# EasyEDA Pro project ProProject_阵列式磁场检测仪_2024-06-02.epro, board PCB3
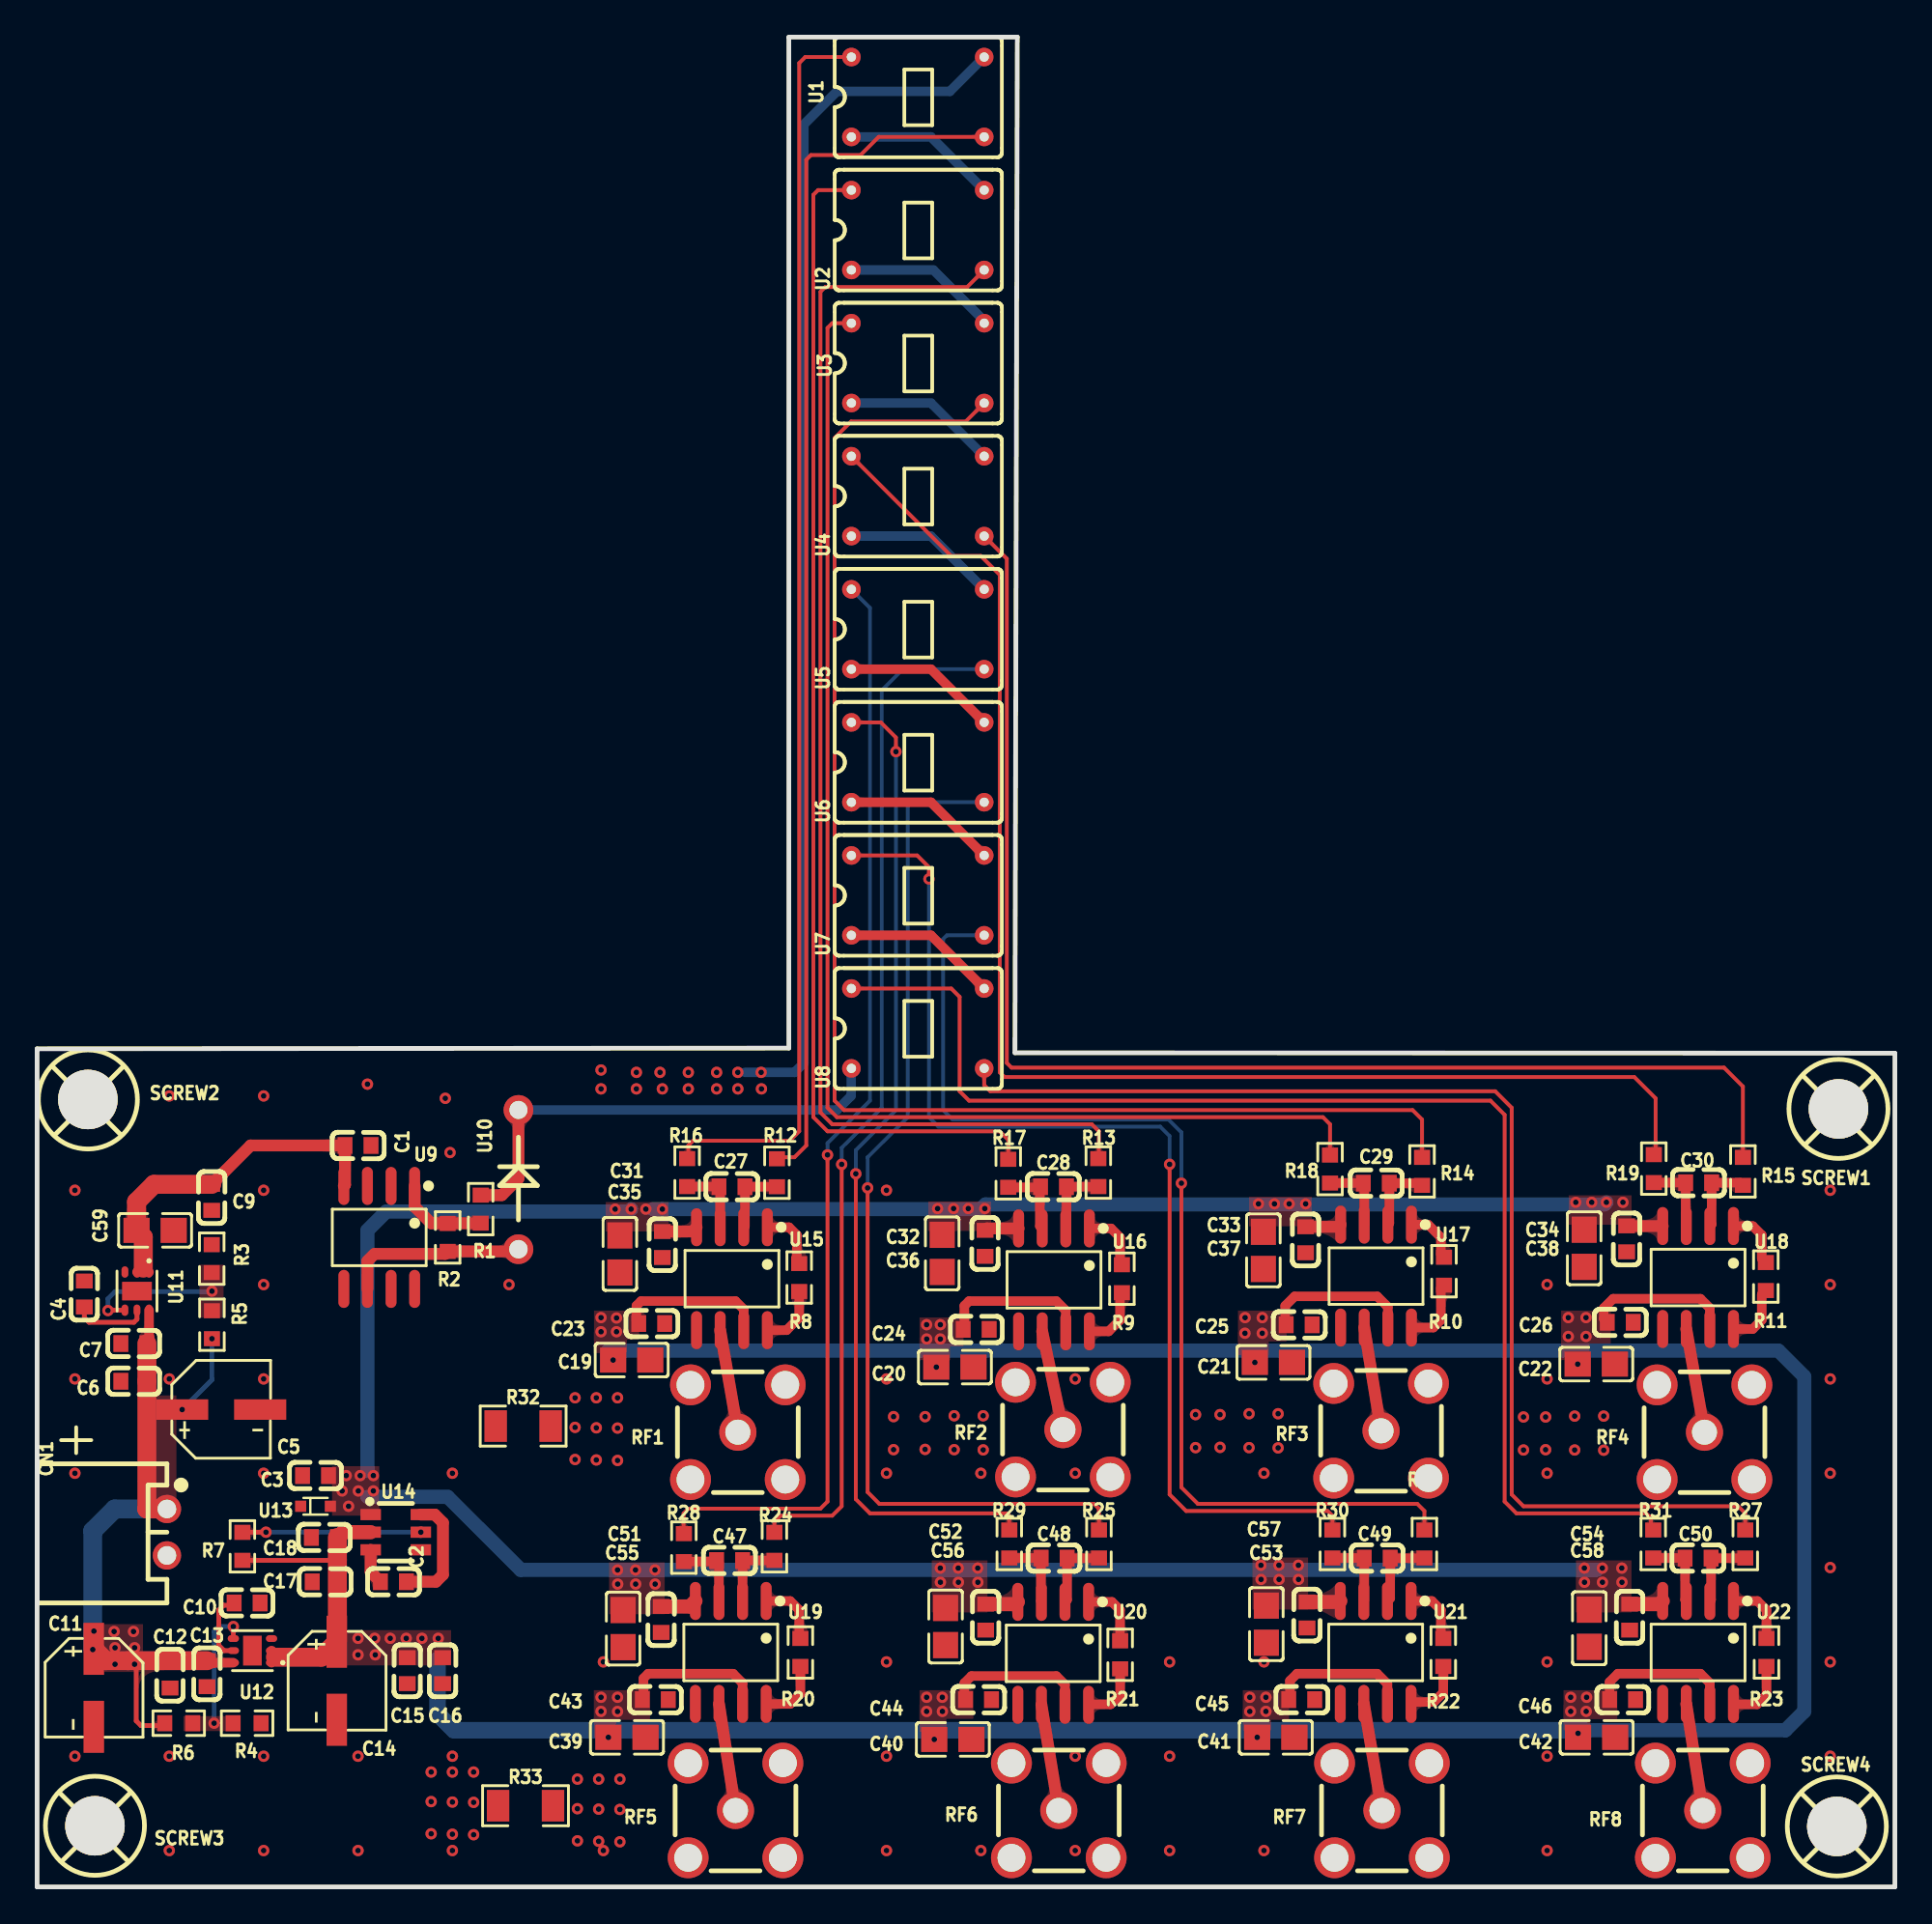
[diagram p8: board, top side]
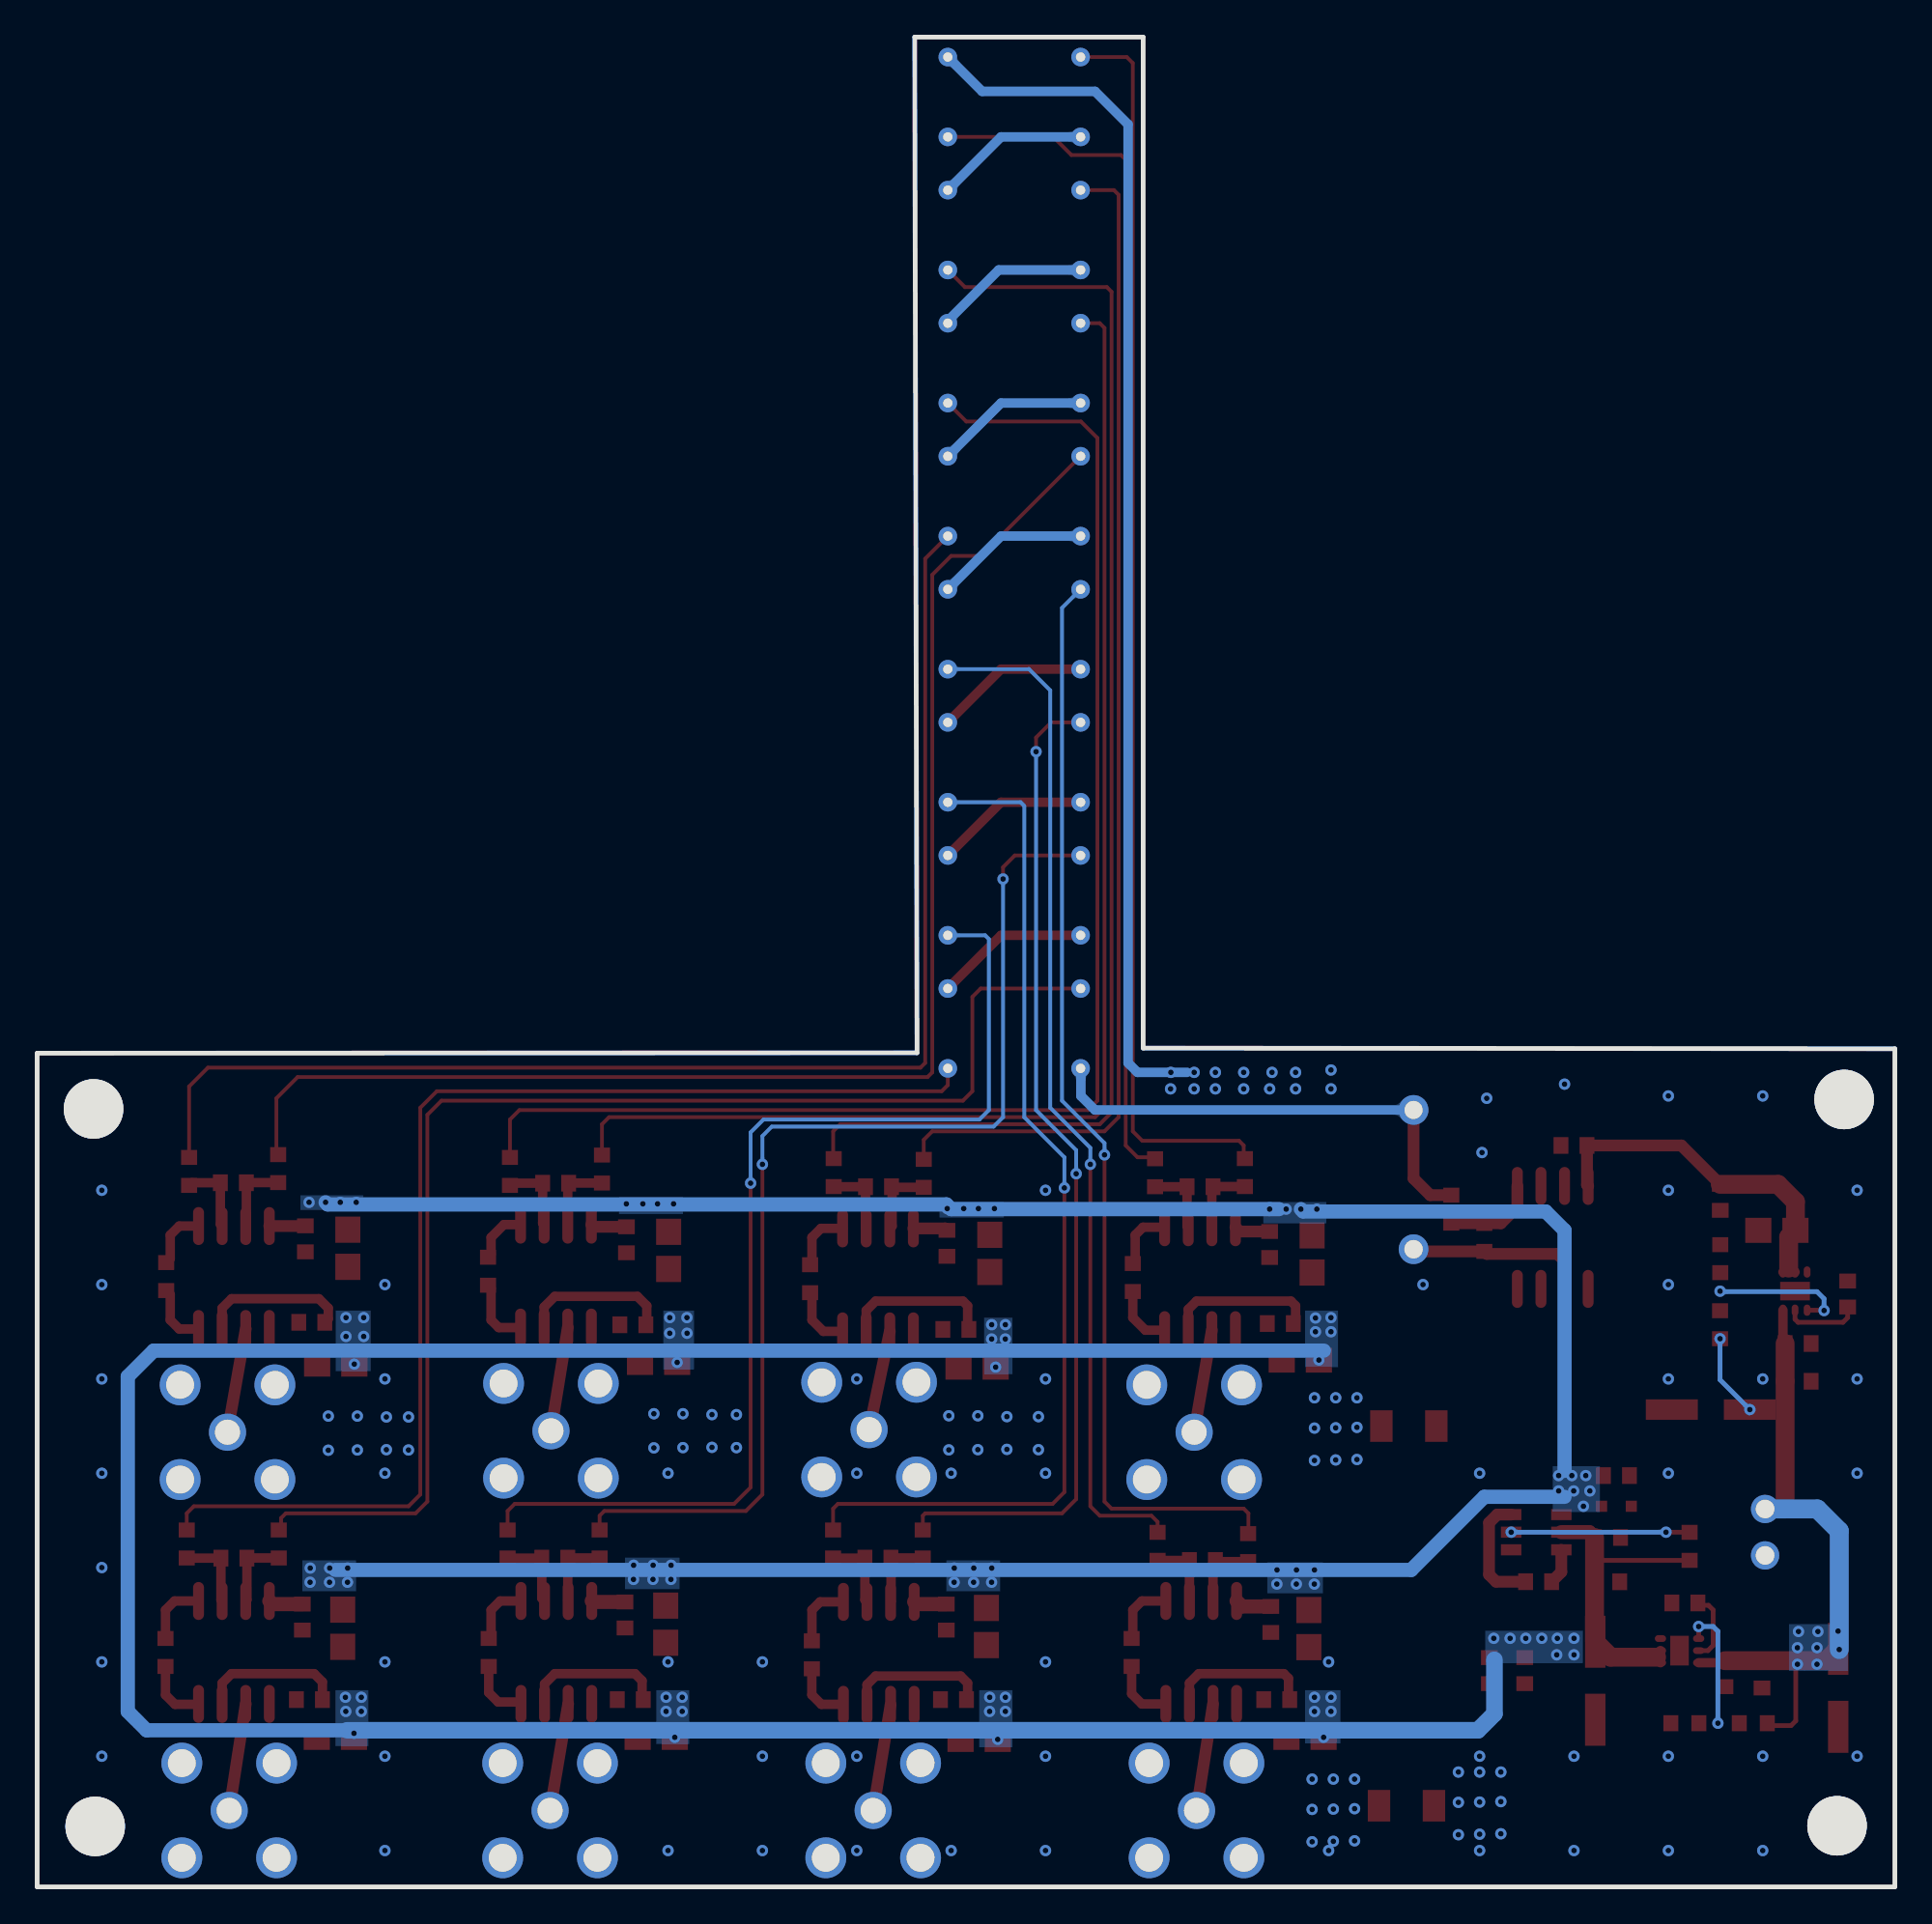
[diagram p9: board, bottom side, seen from below]

Outline 100 x 99.62 mm; copper layers: Top Layer, Bottom Layer. Coordinates in mm from the lower left corner of the outline.
Outline path: 0,45.14 0,0 100,0 100,44.9 52.63,44.92 52.76,99.62 40.46,99.62 40.46,45.17 0,45.14
Stack: Top Layer 0.035mm / Dielectric1 1.51mm FR4 er 4.5 / Bottom Layer 0.035mm

## Design rules (mm)
template: 自定义配置
spacing copperThickness1oz (default): track to track 0.102, other pairs 0.152 to 0.3
spacing copperThickness2oz: track to track 0.203, other pairs 0.152 to 0.3
track width copperThickness1oz (default): min 0.127, default 0.254, max 2.54
track width copperThickness2oz: min 0.203, default 0.254, max 2.54
differential pair differentialPair (default): width min 0.127, default 0.254, max 2.54; gap min 0.152, default 0.152
via viaSize (default): diameter min 0.5, default 0.61, max 10; hole min 0.3, default 0.305, max 6.3

## Placement (name value [footprint] x y rotation side)
C1  100nF  [C0603]  17.27 39.93 180 top
C2  3.3uF  [C0603]  19.18 16.43 180 top
C3  3.3uF  [C0603]  14.99 22.15 0 top
C4  1nF  [C0603]  2.54 31.93 90 top
C5  10uF  [CAP-SMD_BD5.0-L5.3-W5.3-FD]  9.91 25.7 0 top
C6  2.2uF  [C0603]  5.21 27.23 0 top
C7  100nF  [C0603]  5.21 29.26 0 top
C9  2.2uF  [C0603]  9.4 37.14 90 top
C10  1nF  [C0603]  11.3 15.29 0 top
C11  10uF  [CAP-SMD_BD5.0-L5.3-W5.3-FD]  3.05 10.72 270 top
C12  2.2uF  [C0603]  7.15 11.41 90 top
C13  100nF  [C0603]  9.14 11.48 90 top
C14  10uF  [CAP-SMD_BD5.0-L5.3-W5.3-FD]  16.13 11.1 270 top
C15  2.2uF  [C0603]  19.92 11.65 90 top
C16  100nF  [C0603]  21.83 11.65 90 top
C17  3.3uF  [C0603]  15.51 16.43 0 top
C18  100nF  [C0603]  15.46 18.82 0 top
C19  10uF  [C0805]  32 28.37 180 top
C20  10uF  [C0805]  49.4 27.99 180 top
C21  10uF  [C0805]  66.55 28.25 180 top
C22  10uF  [C0805]  83.93 28.15 180 top
C23  100nF  [C0603]  33.08 30.34 180 top
C24  100nF  [C0603]  50.55 30.02 180 top
C25  100nF  [C0603]  67.93 30.27 180 top
C26  100nF  [C0603]  85.22 30.4 180 top
C27  47nF  [C0603]  37.4 37.71 0 top
C28  47nF  [C0603]  54.71 37.71 0 top
C29  47nF  [C0603]  72.09 37.9 0 top
C30  47nF  [C0603]  89.44 37.92 0 top
C31  10uF  [C0805]  31.37 34.09 90 top
C32  10uF  [C0805]  48.72 34.12 90 top
C33  10uF  [C0805]  66.01 34.28 90 top
C34  10uF  [C0805]  83.28 34.39 90 top
C35  100nF  [C0603]  33.65 34.59 90 top
C36  100nF  [C0603]  51.03 34.66 90 top
C37  100nF  [C0603]  68.28 34.85 90 top
C38  100nF  [C0603]  85.56 34.9 90 top
C39  10uF  [C0805]  31.75 8.05 180 top
C40  10uF  [C0805]  49.29 7.94 180 top
C41  10uF  [C0805]  66.67 8.05 180 top
C42  10uF  [C0805]  83.95 8.05 180 top
C43  100nF  [C0603]  33.27 10.08 180 top
C44  100nF  [C0603]  50.67 10.08 180 top
C45  100nF  [C0603]  68.07 10.08 180 top
C46  100nF  [C0603]  85.34 10.08 180 top
C47  47nF  [C0603]  37.27 17.58 0 top
C48  47nF  [C0603]  54.74 17.7 0 top
C49  47nF  [C0603]  72.14 17.7 0 top
C50  47nF  [C0603]  89.41 17.7 0 top
C51  10uF  [C0805]  31.54 13.91 90 top
C52  10uF  [C0805]  48.9 14.02 90 top
C53  10uF  [C0805]  66.17 14.15 90 top
C54  10uF  [C0805]  83.55 13.93 90 top
C55  100nF  [C0603]  33.59 14.4 90 top
C56  100nF  [C0603]  51.06 14.53 90 top
C57  100nF  [C0603]  68.36 14.64 90 top
C58  100nF  [C0603]  85.73 14.53 90 top
C59  10uF  [C0805]  6.35 35.36 0 top
CN1  XH2.54-2P_H弯针插座  [CONN-TH_2P-P2.5_XH2.54-2P_H]  6.98 19.1 270 top
R1  13kΩ  [R0603]  23.88 36.5 90 top
R2  1.3kΩ  [R0603]  22.1 34.98 270 top
R3  24kΩ  [R0603]  9.4 33.83 90 top
R4  24kΩ  [R0603]  11.3 8.81 0 top
R5  150kΩ  [R0603]  9.41 30.28 90 top
R6  150kΩ  [R0603]  7.62 8.81 0 top
R7  10K  [R0603]  11.05 18.34 270 top
R8  499Ω  [R0603]  41.02 32.82 90 top
R9  499Ω  [R0603]  58.39 32.75 90 top
R10  499Ω  [R0603]  75.73 33.16 90 top
R11  499Ω  [R0603]  93.06 32.87 90 top
R12  1kΩ  [R0603]  39.82 38.46 90 top
R13  1kΩ  [R0603]  57.12 38.47 90 top
R14  1kΩ  [R0603]  74.55 38.53 90 top
R15  1kΩ  [R0603]  91.82 38.53 90 top
R16  1kΩ  [R0603]  34.99 38.47 90 top
R17  1kΩ  [R0603]  52.27 38.43 90 top
R18  1kΩ  [R0603]  69.6 38.66 90 top
R19  1kΩ  [R0603]  87.03 38.68 90 top
R20  499Ω  [R0603]  41.08 12.62 90 top
R21  499Ω  [R0603]  58.3 12.5 90 top
R22  499Ω  [R0603]  75.69 12.62 90 top
R23  499Ω  [R0603]  93.09 12.62 90 top
R24  1kΩ  [R0603]  39.69 18.34 90 top
R25  1kΩ  [R0603]  57.16 18.47 90 top
R26  1kΩ  [R0603]  74.68 18.47 90 top
R27  1kΩ  [R0603]  91.95 18.47 90 top
R28  1kΩ  [R0603]  34.81 18.27 90 top
R29  1kΩ  [R0603]  52.33 18.47 90 top
R30  1kΩ  [R0603]  69.72 18.47 90 top
R31  1kΩ  [R0603]  86.99 18.47 90 top
R32  0Ω  [R1206]  26.16 24.82 0 top
R33  0Ω  [R1206]  26.29 4.37 0 top
RF1  BWSMA-KE-Z001  [SMA-TH_BWSMA-KE-Z001]  37.72 24.49 90 top
RF2  BWSMA-KE-Z001  [SMA-TH_BWSMA-KE-Z001]  55.22 24.63 90 top
RF3  BWSMA-KE-Z001  [SMA-TH_BWSMA-KE-Z001]  72.34 24.56 90 top
RF4  BWSMA-KE-Z001  [SMA-TH_BWSMA-KE-Z001]  89.75 24.49 90 top
RF5  BWSMA-KE-Z001  [SMA-TH_BWSMA-KE-Z001]  37.59 4.12 90 top
RF6  BWSMA-KE-Z001  [SMA-TH_BWSMA-KE-Z001]  55 4.12 90 top
RF7  BWSMA-KE-Z001  [SMA-TH_BWSMA-KE-Z001]  72.39 4.12 90 top
RF8  BWSMA-KE-Z001  [SMA-TH_BWSMA-KE-Z001]  89.66 4.12 90 top
SCREW1  -  [M3螺丝]  97.03 41.83 0 top
SCREW2  -  [M3螺丝]  2.79 42.34 0 top
SCREW3  -  [M3螺丝]  3.17 3.23 0 top
SCREW4  -  [M3螺丝]  96.94 3.19 0 top
U1  -  [HALL]  42.93 93.14 90 top
U2  -  [HALL]  42.93 85.98 90 top
U3  -  [HALL]  42.93 78.81 90 top
U4  -  [HALL]  42.93 71.64 90 top
U5  -  [HALL]  42.93 64.48 90 top
U6  -  [HALL]  42.93 57.31 90 top
U7  -  [HALL]  42.93 50.14 90 top
U8  -  [HALL]  42.93 42.98 90 top
U9  LM234DT  [SOIC-8_L4.9-W3.9-P1.27-LS6.0-BL]  18.41 34.98 180 top
U10  -  [IN457]  25.91 34.34 90 top
U11  SGM2211-5.0XTDI6G/TR  [TDFN-6_L2.0-W2.0-P0.65-BL-EP]  5.37 32.09 180 top
U12  SGM2211-5.0XTDI6G/TR  [TDFN-6_L2.0-W2.0-P0.65-BL-EP]  11.59 12.72 90 top
U13  IN4148WT  [SOD-523_L1.2-W0.8-LS1.6-FD]  14.99 20.5 180 top
U14  SGM3204YN6G/TR  [SOT-23-6_L2.9-W1.6-P0.95-LS2.8-BR]  19.3 19.1 180 top
U15  INA101ASOIC8  [SOIC-8_L4.9-W3.9-P1.27-LS6.0-BL]  37.4 32.75 180 top
U16  INA101ASOIC8  [SOIC-8_L4.9-W3.9-P1.27-LS6.0-BL]  54.74 32.69 180 top
U17  INA101ASOIC8  [SOIC-8_L4.9-W3.9-P1.27-LS6.0-BL]  72.07 32.89 180 top
U18  INA101ASOIC8  [SOIC-8_L4.9-W3.9-P1.27-LS6.0-BL]  89.41 32.82 180 top
U19  INA101ASOIC8  [SOIC-8_L4.9-W3.9-P1.27-LS6.0-BL]  37.34 12.62 180 top
U20  INA101ASOIC8  [SOIC-8_L4.9-W3.9-P1.27-LS6.0-BL]  54.69 12.58 180 top
U21  INA101ASOIC8  [SOIC-8_L4.9-W3.9-P1.27-LS6.0-BL]  72.05 12.62 180 top
U22  INA101ASOIC8  [SOIC-8_L4.9-W3.9-P1.27-LS6.0-BL]  89.41 12.62 180 top

## Footprints (pads in the part's own frame, mm; a bottom-side part is the same pattern mirrored in y, then rotated)
C0603
  rect 0.8x0.9 smd: 1(-0.7,0) 2(0.7,0)
C0805
  rect 1.41x1.35 smd: 1(-1,0) 2(1,0)
CAP-SMD_BD5.0-L5.3-W5.3-FD
  rect 2.8x1.1 smd: 1(-2.1,0) 2(2.1,0)
CONN-TH_2P-P2.5_XH2.54-2P_H
  round 1.524 hole 1: 1(-1.25,0) 2(1.25,0)
HALL
  round 1 hole 0.5: 1(1.104,-0.904) 2(1.104,-8.053) 3(5.404,-8.053) 4(5.404,-0.904)
IN457
  round 1.6 hole 0.99x0.97: 1(0,0)
  round 1.6 hole 0.97: 2(7.5,0)
M3螺丝
  round 3.2 hole 3.2: 1(-0.064,0.064)
R0603
  rect 0.806x0.864 smd: 1(-0.753,0) 2(0.753,0)
R1206
  rect 1.208x1.701 smd: 1(-1.479,0) 2(1.479,0)
SMA-TH_BWSMA-KE-Z001
  round 2.2 hole 1.5: 1(-2.55,-2.55) 2(-2.55,2.55) 3(2.55,2.55) 4(2.55,-2.55)
  round 2 hole 1.35: 5(0,0)
SOD-523_L1.2-W0.8-LS1.6-FD
  rect 0.6x0.6 smd: 1(-0.8,0) 2(0.8,0)
SOIC-8_L4.9-W3.9-P1.27-LS6.0-BL
  oval 0.588x2.045 smd: 1(-1.905,-2.772) 2(-0.635,-2.772) 3(0.635,-2.772) 4(1.905,-2.772) 5(1.905,2.772) 6(0.635,2.772) 7(-0.635,2.772) 8(-1.905,2.772)
SOT-23-6_L2.9-W1.6-P0.95-LS2.8-BR
  rect 1.1x0.6 smd: 1(1.35,-0.95) 2(1.35,0) 3(1.35,0.95) 4(-1.35,0.95) 5(-1.35,0) 6(-1.35,-0.95)
TDFN-6_L2.0-W2.0-P0.65-BL-EP
  oval 0.364x0.607 smd: 1(-0.65,-1.028) 2(0,-1.028) 3(0.65,-1.028) 4(0.65,1.028) 5(0,1.028) 6(-0.65,1.028)
  rect 1.6x1 smd: 7(0,0)

## Nets
As in the schematic.

Pads without a net: SCREW1 1; SCREW2 1; SCREW3 1; SCREW4 1; U9 2 3 5 7 8

## Via types
v1: diameter 0.61, hole 0.305, Top Layer to Bottom Layer, 241 vias

## Routing (per net, layer and track width the routed paths; a pad name or vN(x,y) marks a point on that pad's centre or on a via; arc(x,y) is an arc through that point)
5V: length 241.2
  Top Layer w0.254: 16.16,17.61 16.14,17.59 R7.2
  Top Layer w0.508: U12.2 U12.1 ; C24.2 49.91,30.09 49.91,31.29 50.17,31.55 54.86,31.55 55.37,31.04 U16.7 ; C23.2 32.26,30.46 32.26,31.29 32.51,31.55 37.59,31.55 38.04,31.1 U15.7 ; C43.2 32.64,10.15 32.64,11.23 32.89,11.48 37.46,11.48 37.97,10.97 U19.7 ; C45.2 67.44,10.15 67.44,11.1 67.82,11.48 72.14,11.48 72.69,10.93 U21.7 ; C26.2 84.33,30.59 84.33,31.17 84.84,31.67 89.53,31.67 90.04,31.17 U18.7 ; C25.2 67.18,30.32 67.18,31.29 67.69,31.8 72.14,31.8 72.71,31.23 72.71,30.12 ; C46.2 84.64,11.03 85.09,11.48 89.53,11.48 90.04,10.97 U22.7 ; C44.2 49.91,10.15 49.91,10.97 50.29,11.35 54.86,11.35 55.33,10.89 U20.7
  Top Layer w0.762: C18.2 16.45,19.1 U14.2
  Top Layer w1.016: 12.83,12.37 15.3,12.37 C14.1 16.16,13.24 C18.2
  Bottom Layer w0.762: 83.31,8.43 94.11,8.43 95.12,9.45 95.12,27.48 93.73,28.88 30.73,28.88
  Bottom Layer w0.889: 83.31,8.43 22.44,8.43 21.55,9.32 21.55,12.23
  vias: v1(17.27,13.39) v1(17.27,12.5) v1(18.17,13.39) v1(18.2,12.5) v1(19.01,13.39) v1(19.87,13.39) v1(20.71,13.39) v1(21.59,13.39) v1(30.35,30.66) v1(30.35,29.9) v1(30.35,10.21) v1(30.35,9.45) v1(30.75,8.05) v1(31,28.37) v1(31.19,30.64) v1(31.19,29.9) v1(31.24,10.21) v1(31.24,9.44) v1(47.88,30.28) v1(47.88,29.51) v1(47.88,10.21) v1(47.88,9.45) v1(48.29,7.94) v1(48.4,27.99) v1(48.62,30.28) v1(48.62,29.51) v1(48.72,10.21) v1(48.73,9.45) v1(65.02,30.66) v1(65.02,29.82) v1(65.28,10.21) v1(65.28,9.45) v1(65.55,28.25) v1(65.67,8.05) v1(65.95,30.66) v1(65.95,29.82) v1(66.14,10.21) v1(66.14,9.45) v1(82.42,30.66) v1(82.42,29.64) v1(82.55,10.21) v1(82.55,9.45) v1(82.93,28.15) v1(82.95,8.27) v1(83.38,30.66) v1(83.38,29.64) v1(83.39,9.45) v1(83.41,10.21)
9V: length 40.1
  Top Layer w0.254: R6.1 6.74,8.69 5.59,8.69 5.33,8.94 5.33,11.72 4.87,12.18
  Top Layer w0.508: 9.14,12.18 9.25,12.07 U12.6 ; U11.6 6.02,29.38 C7.2
  Top Layer w1.016: CN1.1 5.9,20.35 5.91,20.35 C6.2 C7.2 ; 9.14,12.18 3.69,12.18 C11.1
  Bottom Layer w0.254: v1(7.81,25.7) 9.41,27.31 v1(9.41,29.52)
  Bottom Layer w1.016: CN1.1 4.17,20.35 2.99,19.17 v1(2.99,12.78)
  vias: v1(3.05,13.77) v1(4.14,13.75) v1(4.19,12.88) v1(4.19,11.99) v1(5.19,13.75) v1(5.25,12.88) v1(5.24,11.99)
-5V: length 162
  Top Layer w0.635: U17.4 70.05,35.55 C37.2 ; C35.2 35.27,35.3 U15.4 ; U18.4 85.57,35.59 C38.2 ; U16.4 51.13,35.46 C36.2
  Top Layer w0.762: U19.4 35.14,15.1 C55.2 ; 85.73,15.23 87.34,15.23 U22.4 ; 51.06,15.23 52.67,15.23 U20.4 ; U21.4 70.09,15.34 C57.2
  Bottom Layer w0.762: 17.78,21.01 22.1,21.01 26.03,17.07 v1(31.24,17.07) v1(32.21,17.07) v1(33.26,17.07) 83.95,17.07 ; v1(84.47,36.87) 84.36,36.75 51.05,36.75 50.8,36.5 v1(33.65,36.5) 33.15,36.5 ; 17.78,22.4 17.78,35.36 18.8,36.37 31.85,36.37 v1(31.97,36.5)
  vias: v1(16.42,21.32) v1(16.64,22.15) v1(16.76,20.5) v1(17.29,21.32) v1(17.39,22.15) v1(18.1,22.15) v1(18.1,21.32) v1(31.11,36.5) v1(31.25,16.31) v1(32.22,16.31) v1(32.77,36.5) v1(33.27,16.31) v1(48.47,36.53) v1(48.61,17.17) v1(48.62,16.41) v1(49.33,36.53) v1(49.58,17.17) v1(49.59,16.41) v1(50.12,36.53) v1(50.63,17.17) v1(50.64,16.41) v1(51.01,36.53) v1(65.74,36.79) v1(65.88,17.32) v1(65.88,16.56) v1(66.6,36.79) v1(66.84,17.32) v1(66.85,16.56) v1(67.39,36.79) v1(67.89,17.32) v1(67.9,16.56) v1(68.28,36.79) v1(82.82,36.87) v1(83.29,17.17) v1(83.29,16.41) v1(83.68,36.87) v1(84.25,17.17) v1(84.26,16.41) v1(85.36,36.87) v1(85.3,17.17) v1(85.31,16.41)
AGND: length 65.1
  Bottom Layer w0.508: 38.1,43.87 v1(38.97,43.87) 40.77,43.87 41.27,44.37 41.27,94.92 43.05,96.7 49.13,96.7 U1.3
  vias: v1(17.78,43.23) v1(21.97,42.47) v1(22.22,39.55) v1(25.4,32.44) v1(28.96,26.34) v1(28.96,24.75) v1(28.96,23.02) v1(29.08,5.8) v1(29.08,4.21) v1(29.08,2.48) v1(30.1,26.34) v1(30.1,24.72) v1(30.1,22.99) v1(30.23,5.8) v1(30.23,4.19) v1(30.23,2.46) v1(30.35,43.99) v1(30.35,42.98) v1(30.48,12.12) v1(30.48,1.96) v1(31.24,26.34) v1(31.24,24.71) v1(31.24,22.96) v1(31.37,5.8) v1(31.37,4.17) v1(31.37,2.43) v1(32.26,43.87) v1(32.26,42.98) v1(33.53,43.87) v1(33.65,42.98) v1(35.05,43.87) v1(35.05,42.98) v1(36.58,43.87) v1(36.58,42.98) v1(37.72,43.87) v1(37.72,42.98) v1(38.99,42.98) v1(45.72,37.52) v1(45.72,27.36) v1(45.72,22.28) v1(45.72,12.12) v1(45.72,7.04) v1(45.72,1.96) v1(46.1,25.32) v1(46.1,23.55) v1(47.8,25.32) v1(47.8,23.56) v1(49.36,25.37) v1(49.36,23.55) v1(50.8,22.28) v1(50.8,1.96) v1(50.93,25.37) v1(50.93,23.53) v1(55.88,27.36) v1(55.88,22.28) v1(55.88,7.04) v1(55.88,1.96) v1(60.96,12.12) v1(60.96,7.04) v1(60.96,1.96) v1(62.36,25.43) v1(62.36,23.66) v1(63.67,25.43) v1(63.67,23.67) v1(65.24,25.48) v1(65.24,23.66) v1(66.04,22.28) v1(66.04,12.12) v1(66.04,1.96) v1(66.8,25.48) v1(66.8,23.64) v1(80.01,25.31) v1(80.01,23.53) v1(81.28,32.44) v1(81.28,27.36) v1(81.2,25.31) v1(81.2,23.54) v1(81.28,22.28) v1(81.28,12.12) v1(81.28,7.04) v1(81.28,1.96) v1(82.76,25.35) v1(82.76,23.53) v1(84.33,25.35) v1(84.33,23.52) v1(96.52,37.52) v1(96.52,32.44) v1(96.52,27.36) v1(96.52,22.28) v1(96.52,17.2) v1(96.52,12.12) v1(96.52,7.04)
PGND:
  vias: v1(2.03,37.52) v1(2.03,27.36) v1(2.03,22.28) v1(2.03,7.04) v1(7.11,42.6) v1(7.11,27.36) v1(7.11,7.04) v1(7.11,1.96) v1(12.19,42.6) v1(12.19,37.52) v1(12.19,32.44) v1(12.19,27.36) v1(12.19,22.28) v1(12.19,7.04) v1(12.19,1.96) v1(17.27,7.04) v1(17.27,1.96) v1(21.21,6.18) v1(21.21,4.59) v1(21.21,2.86) v1(22.35,22.28) v1(22.35,7.04) v1(22.35,6.18) v1(22.35,4.57) v1(22.35,2.84) v1(22.35,1.96) v1(23.49,6.18) v1(23.49,4.55) v1(23.49,2.81)
VCC234: length 19.1
  Top Layer w0.508: U11.2 U11.1
  Top Layer w0.635: U9.4 16.57,37.81 C1.2 11.49,39.93 C9.2
  Top Layer w1.016: 5.71,33.33 5.71,34.99 C59.1 5.35,36.9 6.29,37.84 C9.2
CH1: length 5.6
  Top Layer w0.635: U15.6 RF1.5
CH2: length 5.4
  Top Layer w0.635: U16.6 55.22,24.63
CH3: length 5.6
  Top Layer w0.635: 71.44,30.12 RF3.5
CH4: length 5.6
  Top Layer w0.635: U18.6 RF4.5
CH5: length 5.8
  Top Layer w0.635: 36.7,9.85 RF5.5
CH6: length 5.8
  Top Layer w0.635: U20.6 RF6.5
CH7: length 5.8
  Top Layer w0.635: U21.6 RF7.5
CH8: length 5.8
  Top Layer w0.635: U22.6 RF8.5
I+: length 25.8
  Top Layer w0.635: U10.2 25.91,38.15 25.01,37.25 R1.2
  Bottom Layer w0.508: U10.2 43.06,41.84 43.81,42.6 43.81,44.07 U8.1
O1+: length 67.5
  Top Layer w0.203: U1.4 41.35,98.55 41.02,98.22 41.02,40.69 40.51,40.18 35.31,40.18 35.05,39.93 35.05,39.29 R16.2
O1-: length 65.1
  Top Layer w0.203: 39.7,39.29 40.77,39.29 41.4,39.93 41.4,93.02 41.66,93.27 44.32,93.27 45.3,94.25 U1.2
O2+: length 63.9
  Top Layer w0.203: 52.27,39.18 52.27,40.23 51.82,40.69 42.55,40.69 41.78,41.45 41.78,91.13 42.04,91.38 U2.4
O2-: length 70.4
  Top Layer w0.203: U2.2 50.06,86.16 42.42,86.16 42.16,85.9 42.16,41.71 42.8,41.07 56.77,41.07 57.15,40.69 57.15,39.25 R13.2
O3+: length 72.5
  Top Layer w0.203: U3.4 42.8,84.21 42.55,83.96 42.55,41.96 43.05,41.45 69.21,41.45 69.6,41.07 R18.2
O3-: length 78.6
  Top Layer w0.203: R14.2 74.55,41.33 74.04,41.83 43.43,41.83 42.93,42.34 42.93,78.03 43.81,78.92 49.98,78.92 50.98,79.91
O4+: length 76.4
  Top Layer w0.203: R19.2 87.12,39.53 87.12,42.47 85.98,43.61 52.07,43.61 51.82,43.87 51.82,70.66 50.8,71.68 49.2,71.68 U4.4
O4-: length 72.8
  Top Layer w0.203: R15.2 91.82,43.1 90.8,44.12 52.45,44.12 52.2,44.37 52.2,71.53 U4.2
O5+: length 59.6
  Top Layer w0.203: R28.2 34.8,19.04 34.8,20.12 35.05,20.37 42.16,20.37 42.55,20.75 v1(42.55,39.42)
  Bottom Layer w0.203: v1(42.55,39.42) 42.55,40.06 44.83,42.34 44.83,68.88 43.83,69.88
O5-: length 55.4
  Top Layer w0.203: R24.2 39.69,19.66 40.02,19.99 42.8,19.99 43.31,20.5 v1(43.31,38.91)
  Bottom Layer w0.203: v1(43.31,38.91) 43.31,39.8 45.47,41.96 45.47,64.44 46.61,65.58 U5.2
O6+: length 54
  Top Layer w0.203: v1(44.07,38.41) 44.07,20.88 44.83,20.12 52.2,20.12 52.32,19.99 52.32,19.22 R29.2 ; v1(46.23,61.14) 46.23,61.9 45.41,62.71 U6.4
  Bottom Layer w0.203: v1(46.23,61.14) 46.23,41.83 44.07,39.67 v1(44.07,38.41)
O6-: length 56
  Top Layer w0.203: v1(44.7,37.64) 44.7,21.26 45.34,20.62 56.9,20.62 57.16,20.37 R25.2
  Bottom Layer w0.203: v1(44.7,37.64) 44.7,39.29 46.86,41.45 46.86,58.21 47.07,58.41 U6.2
O7+: length 60.6
  Top Layer w0.203: v1(60.96,38.91) 60.96,21.13 61.85,20.24 69.47,20.24 69.72,19.99 R30.2 ; v1(48.01,54.28) 48.01,54.92 47.37,55.55 U7.4
  Bottom Layer w0.203: v1(60.96,38.91) 60.96,40.44 60.45,40.95 48.51,40.95 48.01,41.45 v1(48.01,54.28)
O7-: length 58.6
  Top Layer w0.203: R26.2 74.68,20.24 74.3,20.62 62.48,20.62 61.59,21.51 v1(61.59,37.9)
  Bottom Layer w0.203: U7.2 48.97,51.25 48.77,51.04 48.77,41.83 49.28,41.33 60.9,41.33 61.59,40.63 v1(61.59,37.9)
O8+: length 70.7
  Top Layer w0.203: R31.2 86.87,19.35 86.87,19.86 86.61,20.12 79.63,20.12 78.99,20.75 78.99,41.58 78.23,42.34 50.17,42.34 49.66,42.85 49.66,47.93 49.21,48.38 U8.4
O8-: length 64.5
  Top Layer w0.203: R27.2 91.95,20.12 91.57,20.5 80.01,20.5 79.37,21.13 79.37,41.96 78.49,42.85 51.31,42.85 50.98,43.18 U8.2
$1N695: length 9.9
  Top Layer w0.635: U10.1 25.79,34.22 R2.2 21.96,34.09 18.16,34.09 17.78,33.71 U9.6
$1N696: length 5.1
  Top Layer w0.635: 22.09,35.74 23.87,35.74 R1.1 ; 22.09,35.74 R2.1 ; 22.09,35.74 21.21,35.74 20.32,36.63 U9.1
$1N1719: length 4.1
  Top Layer w0.254: U11.5 5.37,30.57 5.21,30.4 2.79,30.4 2.54,30.66 C4.1
$1N1720: length 7.3
  Top Layer w0.254: U11.4 3.83,31.06 v1(3.81,31.04)
  Bottom Layer w0.254: v1(3.81,31.04) 3.81,31.67 4.19,32.06 9.38,32.06 v1(9.41,32.08)
$1N2456: length 3.8
  Top Layer w0.254: C10.1 10.48,15.16 10.03,15.16 9.78,14.91 9.78,13 10.06,12.72 U12.5
$1N2457: length 6.7
  Top Layer w0.254: U12.4 v1(10.56,14.02)
  Bottom Layer w0.254: v1(10.56,14.02) 9.78,14.02 9.52,13.77 v1(9.52,8.81)
$1N2463: length 1.9
  Top Layer w0.635: C2.2 17.95,16.96 U14.3
$1N2464: length 6.3
  Top Layer w0.635: C2.1 21.46,16.43 21.84,16.81 21.84,19.61 21.4,20.05 U14.6
$1N2468: length 9.6
  Top Layer w0.254: v1(12.32,19.1) 11.06,19.1 R7.1
  Bottom Layer w0.254: v1(12.32,19.1) v1(20.65,19.1)
$1N5661: length 3.4
  Top Layer w0.508: R8.1 41.02,30.66 40.34,29.98 U15.8
$1N5662: length 3.3
  Top Layer w0.508: U15.1 40.47,35.53 40.89,35.1 40.89,33.7 R8.2
$1N5664: length 3.9
  Top Layer w0.508: R16.1 36.69,37.72 C27.1 36.77,37.64 U15.3
$1N5665: length 3.9
  Top Layer w0.508: U15.2 38.1,35.59 C27.2 R12.1
$1N5674: length 3.4
  Top Layer w0.508: R9.1 58.29,31.9 58.29,30.53 57.68,29.92 U16.8
$1N5675: length 3.4
  Top Layer w0.508: R9.2 58.29,33.61 58.29,34.98 57.81,35.46 U16.1
$1N5677: length 4
  Top Layer w0.508: U16.3 53.98,35.59 53.98,37.67 ; 53.98,37.67 R17.1 ; 53.98,37.67 C28.1
$1N5678: length 4
  Top Layer w0.508: R13.1 57.11,37.71 55.41,37.71 55.41,35.5 U16.2
$1N5687: length 3.7
  Top Layer w0.508: 73.98,30.12 75.15,30.12 75.56,30.53 75.56,32.24 R10.1
$1N5688: length 3
  Top Layer w0.508: R10.2 75.56,34.07 75.56,34.98 74.88,35.67 U17.1
$1N5690: length 4
  Top Layer w0.508: R18.1 71.38,37.91 C29.1 71.44,37.85 U17.3
$1N5691: length 4.1
  Top Layer w0.508: U17.2 72.79,35.75 C29.2 74.43,37.9 R14.1
$1N5700: length 3.4
  Top Layer w0.508: R11.1 92.84,31.9 92.84,30.53 92.35,30.04 U18.8
$1N5701: length 3.3
  Top Layer w0.508: R11.2 92.84,33.84 92.84,35.1 92.35,35.59 U18.1
$1N5703: length 4.1
  Top Layer w0.508: U18.3 88.74,35.62 C30.1 88.73,37.93 R19.1
$1N5704: length 4.1
  Top Layer w0.508: U18.2 90.14,35.69 C30.2 91.68,37.92 R15.1
$1N5713: length 3.5
  Top Layer w0.508: U19.8 40.53,9.85 41.08,10.4 R20.1
$1N5714: length 3.5
  Top Layer w0.508: R20.2 41.02,13.44 41.02,14.91 40.53,15.4 U19.1
$1N5716: length 4.1
  Top Layer w0.508: 36.63,17.52 R28.1 ; 36.63,17.52 C47.1 ; 36.63,17.52 36.7,17.45 36.7,15.4
$1N5717: length 3.9
  Top Layer w0.508: R24.1 39.68,17.58 C47.2 ; U19.2 37.97,17.58
$1N5726: length 3.3
  Top Layer w0.508: R21.1 58.3,10.34 57.78,9.83 56.63,9.83 U20.8
$1N5727: length 3.5
  Top Layer w0.508: R21.2 58.29,13.26 58.29,14.91 57.85,15.35 U20.1
$1N5729: length 4.1
  Top Layer w0.508: 54.03,17.71 C48.1 ; 54.03,17.71 54.03,15.38 U20.3 ; 54.03,17.71 R29.1
$1N5730: length 4.1
  Top Layer w0.508: R25.1 57.15,17.7 C48.2 55.44,15.46 U20.2
$1N5739: length 3.4
  Top Layer w0.508: U21.8 74.06,9.96 75.18,9.96 75.69,10.47 R22.1
$1N5740: length 3.4
  Top Layer w0.508: R22.2 75.56,13.5 75.56,14.91 75.08,15.4 U21.1
$1N5742: length 4
  Top Layer w0.508: R30.1 71.43,17.71 C49.1 71.44,15.42 U21.3
$1N5743: length 4.2
  Top Layer w0.508: R26.1 74.67,17.7 C49.2 72.84,15.55 U21.2
$1N5752: length 3.5
  Top Layer w0.508: U22.8 91.33,9.83 92.58,9.83 93.09,10.34 R23.1
$1N5753: length 3.5
  Top Layer w0.508: R23.2 93.09,14.91 92.6,15.4 U22.1
$1N5755: length 4.1
  Top Layer w0.508: U22.3 88.71,15.46 C50.1 88.7,17.71 R31.1
$1N5756: length 4.2
  Top Layer w0.508: R27.1 91.94,17.7 C50.2 90.11,15.46 U22.2
$1N13134: length 8.3
  Top Layer w0.508: U7.1 48.11,51.25 U8.3
$1N13139: length 8.3
  Top Layer w0.508: U6.1 48.11,58.41 U7.3
$1N13144: length 8.3
  Top Layer w0.508: U6.3 48.11,65.58 U5.1
$1N13149: length 8.3
  Bottom Layer w0.508: 50.98,69.88 48.11,72.75 U4.1
$1N13154: length 8.3
  Bottom Layer w0.508: 43.83,79.91 48.11,79.91 U4.3
$1N13159: length 8.5
  Bottom Layer w0.508: 51.11,84.21 48.24,87.08 U2.1
$1N13164: length 8.3
  Bottom Layer w0.508: U1.1 48.11,94.25 U2.3

## Copper pours and planes (outline as drawn; the poured copper is in the pictures)
5V on Top Layer: 82.17,9.81 83.62,9.81 83.62,8.44 82.17,8.44
5V on Top Layer: 47.5,10.59 50.39,10.59 50.39,9.05 47.5,9.05
5V on Top Layer: 47.5,29.57 49.15,29.57 49.15,28.37 47.5,28.37
5V on Top Layer: 82.17,10.59 85.06,10.59 85.06,9.04 82.17,9.04
5V on Top Layer: 29.97,29.84 31.75,29.84 31.75,28.75 29.97,28.75
5V on Top Layer: 16.16,13.83 22.28,13.83 22.28,11.93 16.16,11.93
5V on Top Layer: 29.97,10.59 31.17,10.59 31.17,8.03 29.97,8.03
5V on Top Layer: 64.9,10.59 67.39,10.59 67.39,8.99 64.9,8.99
5V on Top Layer: 64.64,29.9 66.29,29.9 66.29,28.63 64.64,28.63
5V on Top Layer: 29.97,31.04 32.4,31.04 32.4,29.47 29.97,29.47
5V on Top Layer: 82.04,29.87 83.57,29.87 83.57,28.37 82.04,28.37
5V on Top Layer: 64.64,31.04 67.25,31.04 67.25,29.38 64.64,29.38
5V on Top Layer: 64.9,9.58 66.42,9.58 66.42,8.43 64.9,8.43
5V on Top Layer: 29.97,10.59 32.99,10.59 32.99,8.99 29.97,8.99
5V on Top Layer: 82.04,31.04 84.71,31.04 84.71,29.26 82.04,29.26
5V on Top Layer: 47.5,9.82 48.95,9.82 48.95,8.35 47.5,8.35
5V on Top Layer: 47.5,30.66 49.87,30.66 49.87,29.1 47.5,29.1
5V on Bottom Layer: 47.5,30.66 49.02,30.66 49.02,27.61 47.5,27.61
5V on Bottom Layer: 29.84,10.59 31.75,10.59 31.75,7.73 29.84,7.73
5V on Bottom Layer: 29.97,31.04 31.75,31.04 31.75,27.99 29.97,27.99
5V on Bottom Layer: 47.5,10.59 49.29,10.59 49.29,7.52 47.5,7.52
5V on Bottom Layer: 64.9,10.59 66.67,10.59 66.67,7.69 64.9,7.69
5V on Bottom Layer: 64.64,31.04 66.29,31.04 66.29,27.86 64.64,27.86
5V on Bottom Layer: 16.79,13.8 22.05,13.8 22.05,12.05 16.79,12.05
5V on Bottom Layer: 82.17,10.59 83.95,10.59 83.95,7.58 82.17,7.58
5V on Bottom Layer: 82.04,31.04 83.93,31.04 83.93,27.78 82.04,27.78
9V on Top Layer: 5.59,26.47 7.49,26.47 7.49,20.62 5.59,20.62
9V on Top Layer: 2.92,14.15 5.7,14.15 5.7,11.57 2.92,11.57
9V on Bottom Layer: 2.52,14.15 5.7,14.15 5.7,11.63 2.52,11.63
-5V on Top Layer: 15.88,22.66 18.41,22.66 18.41,19.99 15.88,19.99
-5V on Top Layer: 82.44,37.25 85.83,37.25 85.83,35.66 82.44,35.66
-5V on Top Layer: 65.42,17.73 68.41,17.73 68.41,14.93 65.42,14.93
-5V on Top Layer: 30.79,17.48 33.78,17.48 33.78,14.68 30.79,14.68
-5V on Top Layer: 65.24,37.17 68.62,37.17 68.62,35.58 65.24,35.58
-5V on Top Layer: 82.83,17.58 85.82,17.58 85.82,14.78 82.83,14.78
-5V on Top Layer: 30.61,36.88 33.99,36.88 33.99,35.3 30.61,35.3
-5V on Top Layer: 47.96,36.91 51.35,36.91 51.35,35.33 47.96,35.33
-5V on Top Layer: 48.16,17.58 51.15,17.58 51.15,14.78 48.16,14.78
-5V on Bottom Layer: 30.79,17.48 33.78,17.48 33.78,15.81 30.79,15.81
-5V on Bottom Layer: 47.96,36.91 51.43,36.91 51.43,36.05 47.96,36.05
-5V on Bottom Layer: 30.61,36.88 33.99,36.88 33.99,35.73 30.61,35.73
-5V on Bottom Layer: 82.44,37.25 85.83,37.25 85.83,36.45 82.44,36.45
-5V on Bottom Layer: 15.88,22.66 18.41,22.66 18.41,20.19 15.88,20.19
-5V on Bottom Layer: 48.16,17.58 51.06,17.58 51.06,15.92 48.16,15.92
-5V on Bottom Layer: 65.42,17.73 68.36,17.73 68.36,16.03 65.42,16.03
-5V on Bottom Layer: 82.83,17.58 85.73,17.58 85.73,15.92 82.83,15.92
-5V on Bottom Layer: 65.24,37.17 68.68,37.17 68.68,36.24 65.24,36.24
AGND on Top Layer: 15.11,45.64 15.11,28.63 27.43,28.63 27.43,-3 27.56,-3.12 105.28,-3.12 105.79,-2.62 105.79,47.3 105.16,47.93 97.5,47.93 94.47,44.9 16.38,45.64
AGND on Bottom Layer: 15.11,45.64 15.11,28.63 27.43,28.63 27.43,-3 27.56,-3.12 105.28,-3.12 105.79,-2.62 105.79,47.3 105.16,47.93 97.5,47.93 94.47,44.9 16.38,45.64
PGND on Top Layer: -1.52,45.14 13.89,45.14 13.89,27.74 24.77,27.74 25.27,-2.49 -3.05,-3.12 -1.78,44.76
PGND on Bottom Layer: -1.59,45.01 13.82,45.01 13.82,27.61 24.7,27.61 25.21,-2.62 -3.11,-3.25 -1.84,44.63
$1N1720 on Top Layer: 8.74,33.5 10.03,33.5 10.03,30.66 8.74,30.66
$1N2457 on Top Layer: 7.87,9.19 10.92,9.19 10.92,8.39 7.87,8.39

Small or netless copper shapes (teardrops, artwork), in the pictures only: 199 on Top Layer, 33 on Bottom Layer

## Text on the board
Top Silkscreen Layer: +
